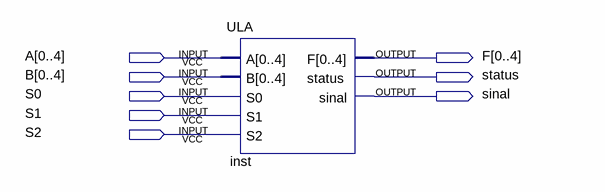
[diagram p0: schematic sheet]
// Quartus schematic projeto_SD.bdf as structural Verilog: 1 symbols, 8 pins
module projeto_SD (
  input  [0:4] A,
  input  [0:4] B,
  input  S0,
  input  S1,
  input  S2,
  output [0:4] F,
  output status,
  output sinal
);

  ULA inst (.A(A), .B(B), .S0(S0), .S1(S1), .S2(S2), .F(F), .status(status), .sinal(sinal));
endmodule
